# EAGLE design LilyPixel (EAGLE 6.4)
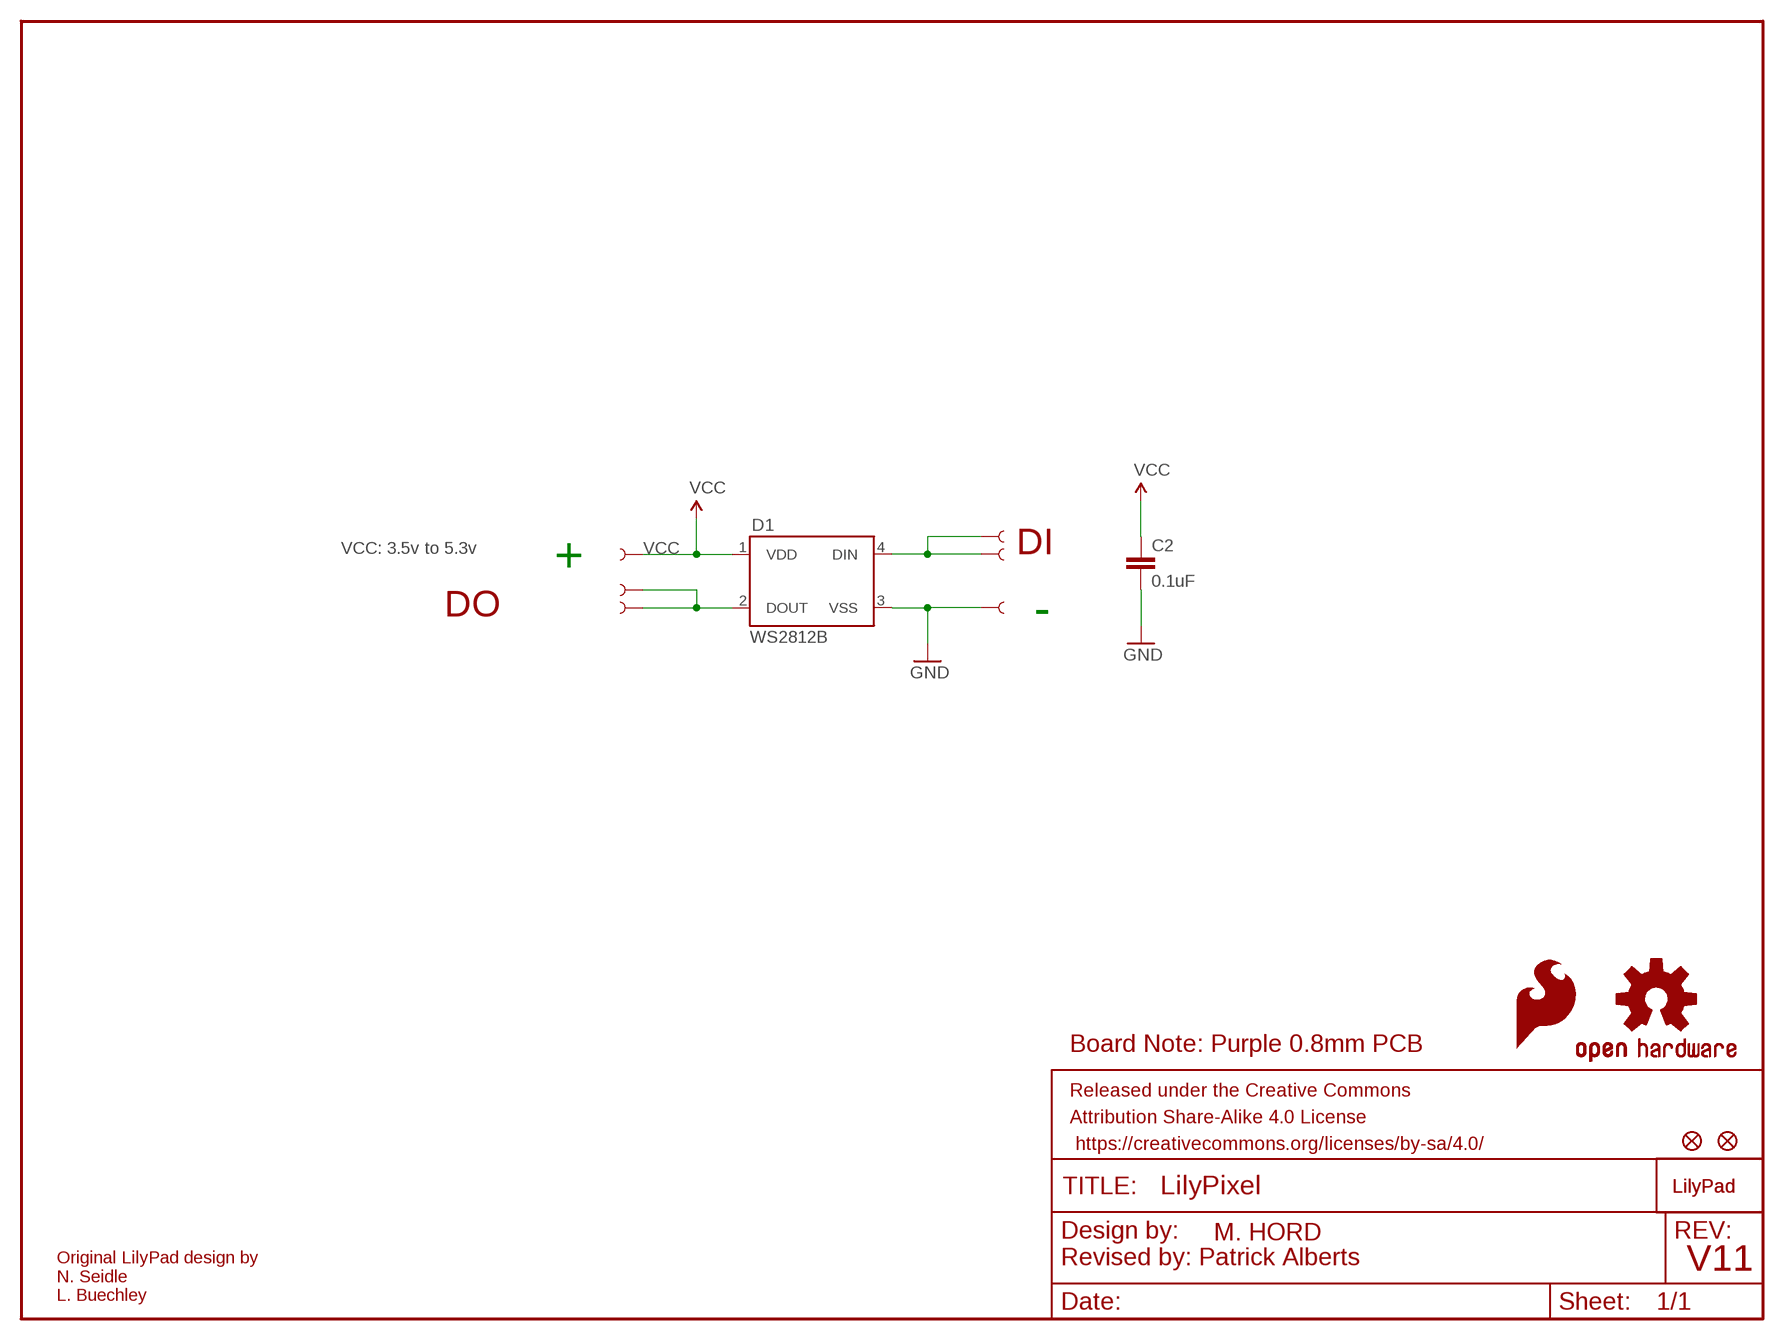
[diagram p0: schematic, sheet 1]

## Parts
C2  0.1uF  0.1UF-25V(+80/-20%)(0603)  [0603-CAP]
D1  WS2812B  [WS2812B]
FID1  FIDUCIALUFIDUCIAL  [MICRO-FIDUCIAL]
FID2  FIDUCIALUFIDUCIAL  [MICRO-FIDUCIAL]
FRAME1  FRAME-LETTER  [CREATIVE_COMMONS]
JP1  SEWTAP6  [PETAL-SMALL-2SIDE]
JP2  SEWTAP6  [PETAL-SMALL-2SIDE]
JP3  SEWTAP6  [PETAL-SMALL-2SIDE]
JP4  SEWTAP6  [PETAL-SMALL-2SIDE]
JP5  SEWTAP6  [PETAL-SMALL-2SIDE]
JP6  SEWTAP6  [PETAL-SMALL-2SIDE]
LOGO1  OSHW-LOGOS  [OSHW-LOGO-S]
LOGO2  SFE_LOGO_FLAME.1_INCH  [SFE_LOGO_FLAME_.1]
U$1  LOGO-LPLP  [LOGO-LILYPAD]
U$8  LOGO-LPL  [LOGO-L]

## Nets
DI1: D1.4(DIN) JP5.1 JP6.1
DO1: D1.2(DOUT) JP1.1 JP2.1
GND: C2.2 D1.3(VSS) JP3.1
VCC: C2.1 D1.1(VDD) JP4.1

## Notes on the sheet
- VCC: 3.5v to 5.3v | DI
- +
- DO
- -
- Board Note: Purple 0.8mm PCB
- M. HORD
- Revised by: Patrick Alberts | V11
- Original LilyPad design by
  N. Seidle
  L. Buechley

## Library data of the parts
C2 = SparkFun-Capacitors:0.1UF-25V(+80/-20%)(0603): CAP-00810 Ceramic Standard decoupling cap; PROD_ID: CAP-00810
D1 = SparkFun-LED:WS2812B: WS2812B - Intelligent control LED integrated light source Technical Specifications: Power Supply Voltage (VDD): 3.5 to 5.3 V Input Voltage (VI): -0.5 to VDD+0.5 V Operating Junction Temperature (Topt): -25°C to +80°C Storage Temperature Range (Tstg): -55°C to +150°C
FID1 FID2 = SparkFun-Aesthetics:FIDUCIAL: Fiducial Alignment Points Various fiducial points for machine vision alignment.
FRAME1 = SparkFun-Aesthetics:FRAME-LETTER: Schematic Frame Standard 8.5x11 US Letter frame
JP1-JP6 = LilyPad-Wearables:SEWTAP
LOGO1 = SparkFun-Aesthetics:OSHW-LOGO: Open Source Hardware Logo This logo indicates the piece of hardware it is found on incorporates a OSHW license and/or adheres to the definition of open source hardware found here: http://freedomdefined.org/OSHW
LOGO2 = SparkFun-Aesthetics:SFE_LOGO_FLAME: SFE Logo, flame only This is the SparkFun flame logo. The logo on the schematic will always be the same size; the package variant is the height of the flame. Default layer for the logo on the board is tSilk.
U$1 U$8 = LilyPad-Wearables:LOGO-LP

## Board
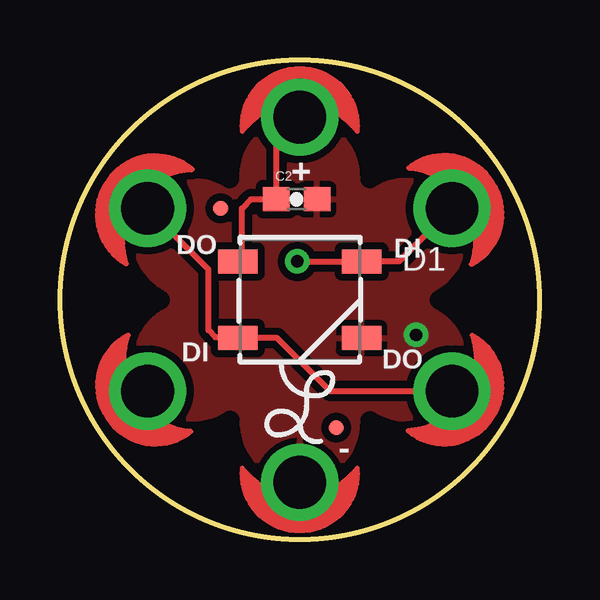
[diagram p1: board, top side]
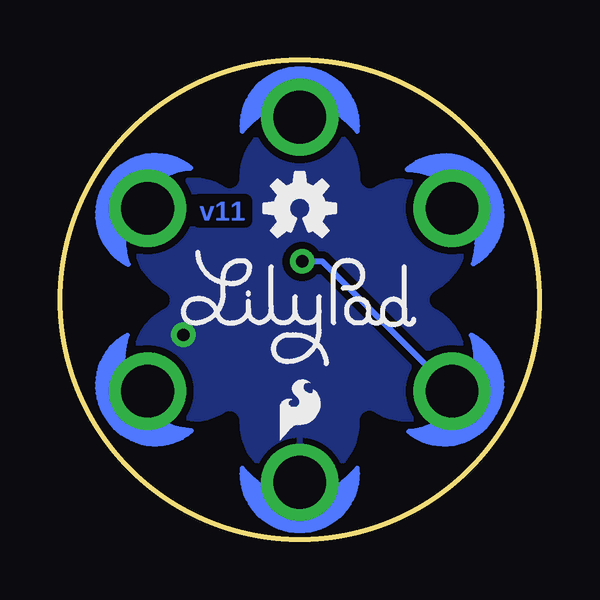
[diagram p2: board, bottom side, seen from below]

Size 20 x 20 mm. Coordinates in mm from the lower left corner, seen from the top.
Outline: circle at 10,10 radius 10
Copper layers (1*16): Top 0.035mm / dielectric 1.5mm / Bottom 0.035mm
Design rules "SparkFun-2-layer": minimum track width 7mil, minimum drill 15mil, track to track 8mil, track to pad 8mil, pad to pad 8mil, via to via 8mil, smd to smd 8mil, copper to edge 8mil, drill to drill 8mil, minimum pad ring 12mil, minimum via ring 10mil, stop-mask expansion 4mil, vias tented up to drill 20mil, thermal gap 10mil
tRestrict: area -0.1,10 to 10,20; area 10,10 to 20.1,20; area 10,-0.1 to 20.1,10; area -0.1,-0.1 to 10,10; 6 lines
bRestrict: area -0.1,10 to 10,20; area 10,10 to 20.1,20; area 10,-0.1 to 20.1,10; area -0.1,-0.1 to 10,10; 6 lines

### Footprints (pad centres in the part's own frame; a part is rotated, then mirrored left to right if it is on the bottom)
0603-CAP = smd 1.1 x 1: 1 -0.85,0; 2 0.85,0
WS2812B = smd 1.651 x 1: 1 -2.577,1.6; 2 -2.577,-1.6; 3 2.577,-1.6; 4 2.577,1.6
MICRO-FIDUCIAL = smd 0.635 x 0.635: 1 0,0
PETAL-SMALL-2SIDE = drill 2.2: 1 0,0

### Placement (x,y rotation side)
C2  9.87,14.19 0 top
D1  10,10 0 top
FID1  11.52,4.67 0 top
FID2  6.7,13.81 0 top
FRAME1  -16.67,-15.4 0 top  (outside the outline)
JP1  3.65,13.81 235 top
JP2  16.35,6.19 56 top
JP3  10,2.38 0 top
JP4  10,17.62 180 top
JP5  16.35,13.81 123 top
JP6  3.65,6.19 303 top
LOGO1  10,13.81 0 bottom
LOGO2  11.14,3.78 0 bottom
U$1  10,10 0 bottom
U$8  10,5.68 0 top

### Tracks (layer width: path | path; a pad name or v marks a point on that pad's centre or on a via)
DI1  (via drill 0.51)
  Top 0.254: JP5.1 14.14,11.6 D1.4 | v9.9,11.6 D1.4 | D1.4
  Bottom 0.254: JP6.1 9.06,11.6 v9.9,11.6
DO1
  Top 0.254: JP2.1 11.27,6.19 9.06,8.4 D1.2 7.55,8.4 7.59,8.44 6.48,8.44 6.19,8.73 6.19,11.27 JP1.1
GND  (via drill 0.51)
  other vias: 14.85,8.53
  pour Bottom (isolate 0.305): 1.11,18.89 1.11,1.11 18.89,1.11 18.89,18.89
  pour Top (isolate 0.305): 1.11,18.89 1.11,1.11 18.89,1.11 18.89,18.89
VCC
  Top 0.254: C2.1 9.02,16.64 JP4.1 | D1.1 7.59,11.6 7.59,13.81 7.97,14.19 C2.1 | 9.04,14.18 C2.1

### Text on the board
Bottom: v11
tPlace: + | DO | DI | DI | DO | -
tValues: M. HORD
tDocu: Board Note: Purple 0.8mm PCB | Mike Hord | Revised by: Patrick Alberts